# EAGLE design M-N-SRAM-V8 (EAGLE 9.6.2)
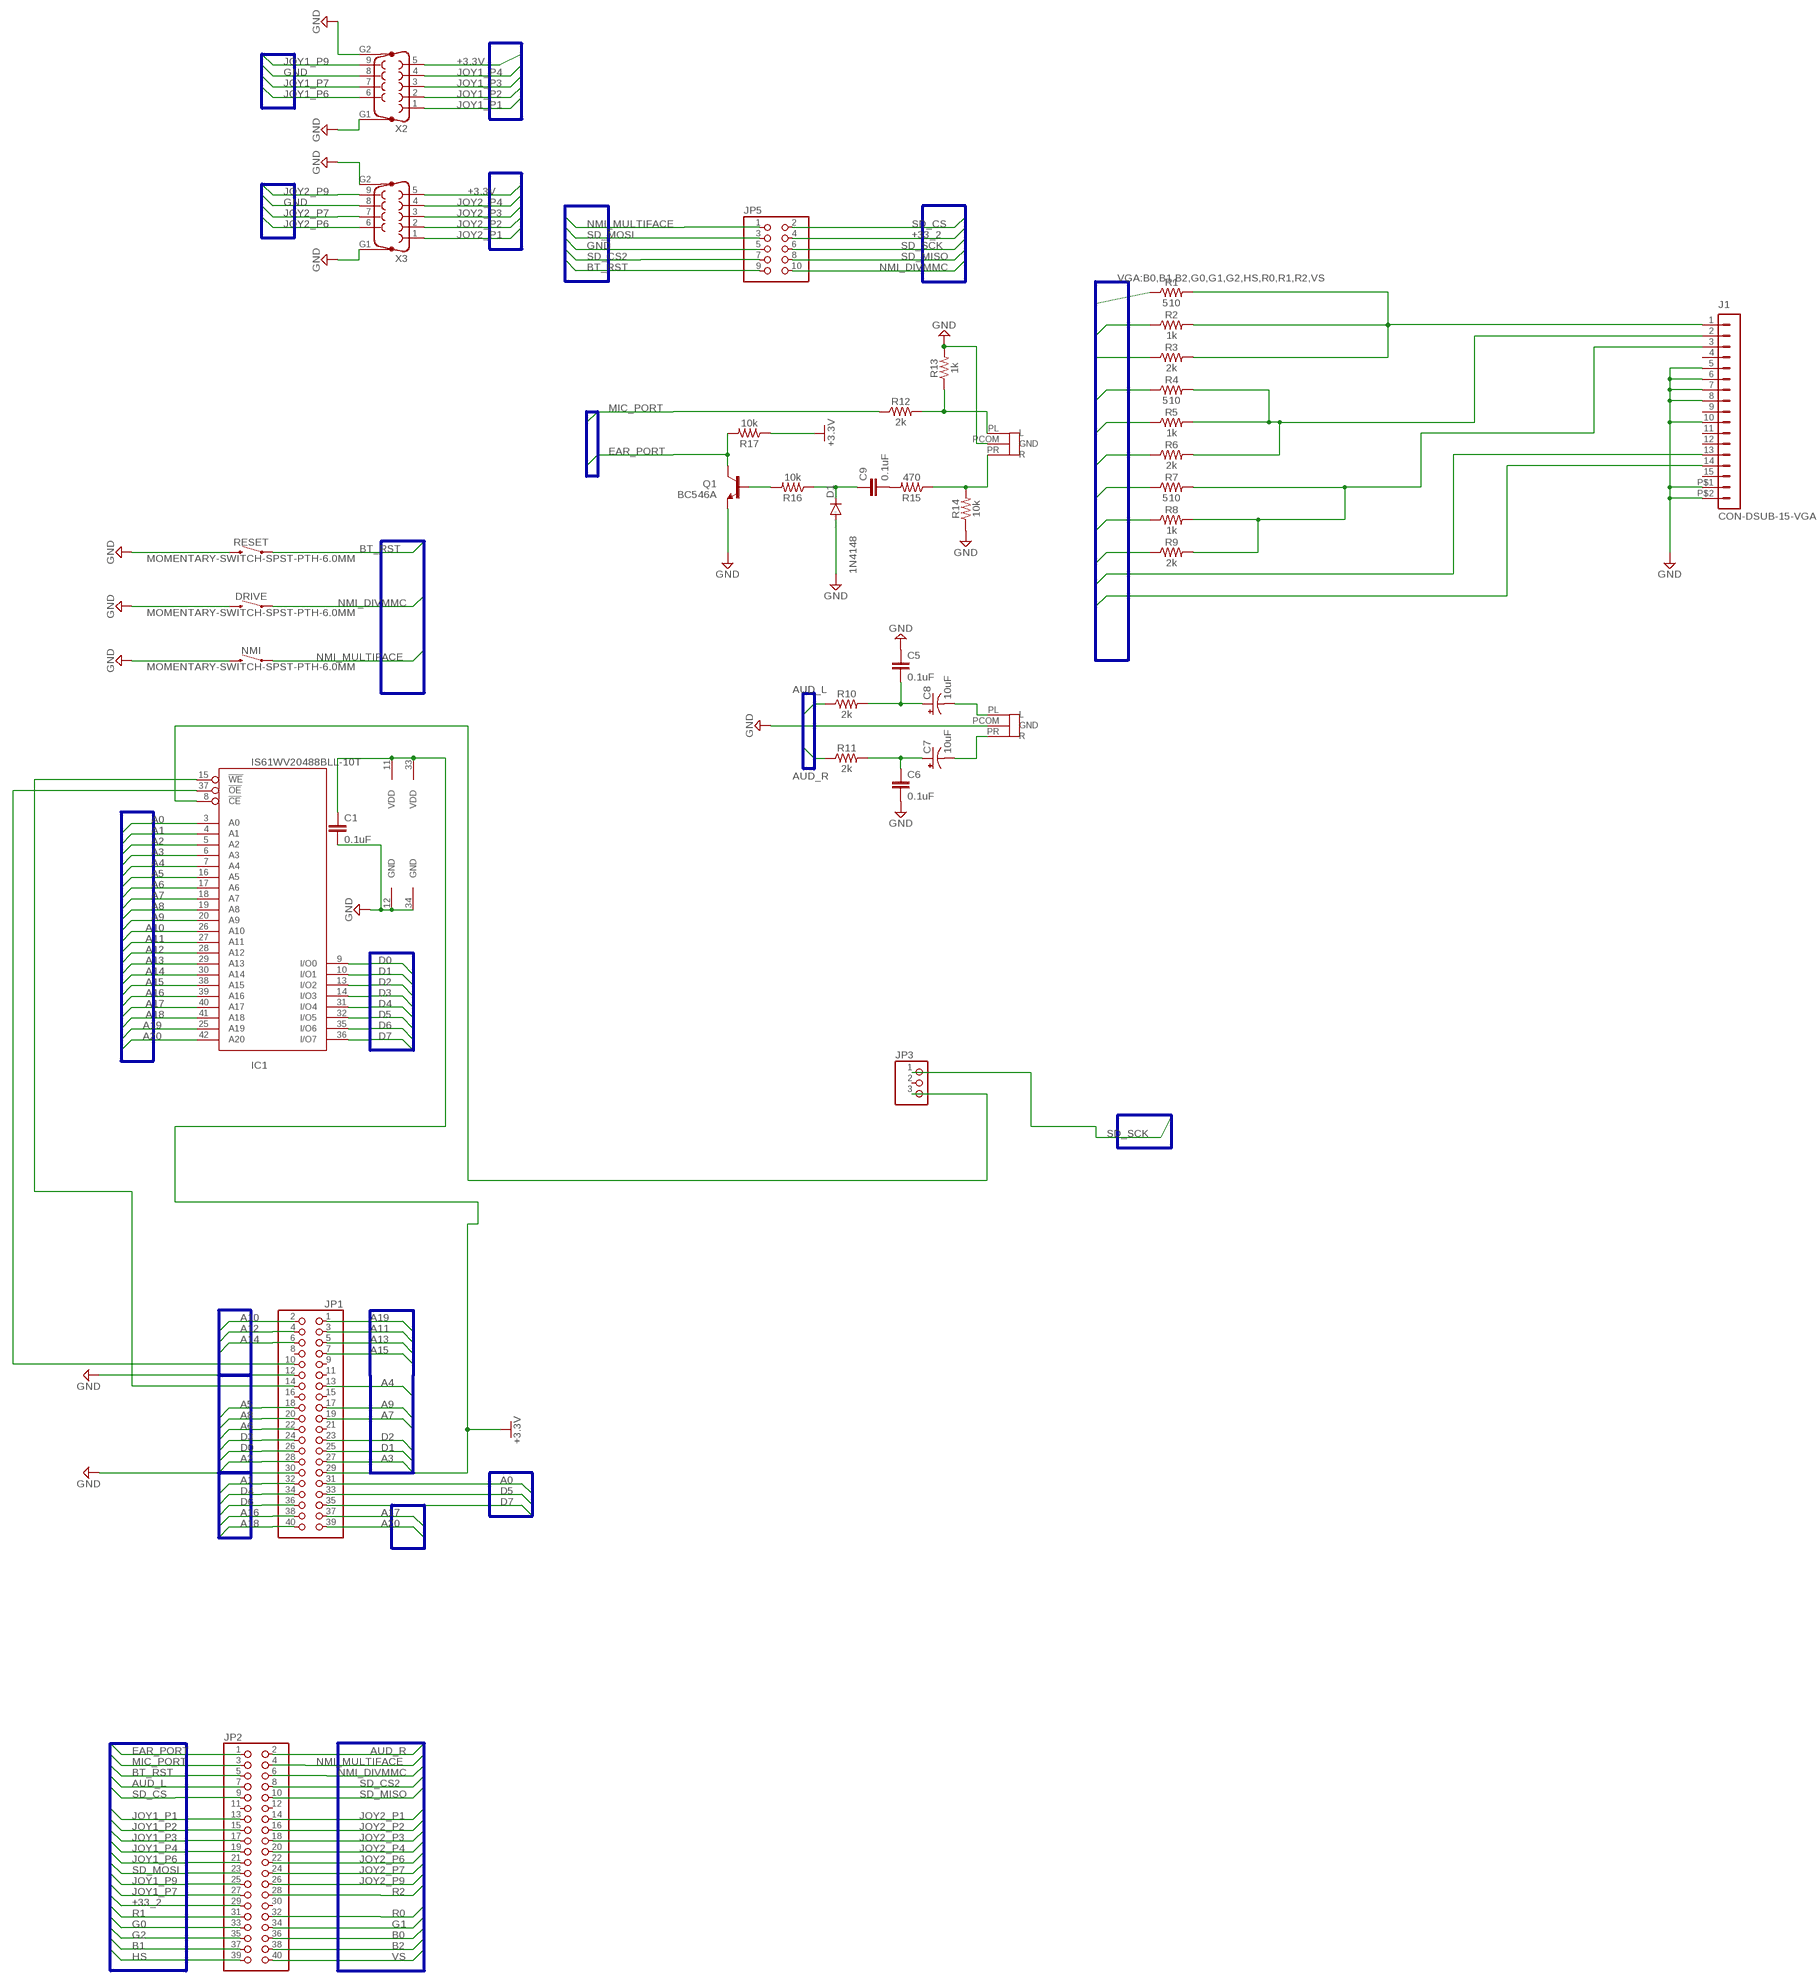
[diagram p0: schematic, sheet 1]

## Parts
AUDIOOUT  AUDIOJACK  [AUDIOJACK]
C1  0.1uF  0.1UF-KIT-EZ-50V-20%  [CAP-PTH-SMALL-KIT]
C5  0.1uF  0.1UF-KIT-EZ-50V-20%  [CAP-PTH-SMALL-KIT]
C6  0.1uF  0.1UF-KIT-EZ-50V-20%  [CAP-PTH-SMALL-KIT]
C7  10uF  10UF-POLAR-RADIAL-2.5MM-25V-20%  [CPOL-RADIAL-2.5MM-5MM]
C8  10uF  10UF-POLAR-RADIAL-2.5MM-25V-20%  [CPOL-RADIAL-2.5MM-5MM]
C9  0.1uF  0.1UF-KIT-EZ-50V-20%  [CAP-PTH-SMALL-KIT]
D1  1N4148  1N4148DO35-7  [DO35-7]
DRIVE  MOMENTARY-SWITCH-SPST-PTH-6.0MM  [TACTILE_SWITCH_PTH_6.0MM]
EAR/MIC  AUDIOJACK  [AUDIOJACK]
IC1  IS61WV20488BLL-10T  IS61WV20488ALL-20T  [TSOP-II-44]
J1  CON-DSUB-15-VGA  [181-015-212-171]
JP1  PINHD-2X20  [2X20]
JP2  PINHD-2X20  [2X20]
JP3  PINHD-1X3  [1X03]
JP5  PINHD-2X5  [2X05]
NMI  MOMENTARY-SWITCH-SPST-PTH-6.0MM  [TACTILE_SWITCH_PTH_6.0MM]
Q1  BC546A  [TO92-EBC]
R1  510  1KOHM-HORIZ-1/4W-1%  [AXIAL-0.3]
R2  1k  1KOHM-HORIZ-1/4W-1%  [AXIAL-0.3]
R3  2k  1KOHM-HORIZ-1/4W-1%  [AXIAL-0.3]
R4  510  1KOHM-HORIZ-1/4W-1%  [AXIAL-0.3]
R5  1k  1KOHM-HORIZ-1/4W-1%  [AXIAL-0.3]
R6  2k  1KOHM-HORIZ-1/4W-1%  [AXIAL-0.3]
R7  510  1KOHM-HORIZ-1/4W-1%  [AXIAL-0.3]
R8  1k  1KOHM-HORIZ-1/4W-1%  [AXIAL-0.3]
R9  2k  1KOHM-HORIZ-1/4W-1%  [AXIAL-0.3]
R10  2k  1KOHM-HORIZ-1/4W-1%  [AXIAL-0.3]
R11  2k  1KOHM-HORIZ-1/4W-1%  [AXIAL-0.3]
R12  2k  1KOHM-HORIZ-1/4W-1%  [AXIAL-0.3]
R13  1k  1KOHM-HORIZ-1/4W-1%  [AXIAL-0.3]
R14  10k  1KOHM-HORIZ-1/4W-1%  [AXIAL-0.3]
R15  470  1KOHM-HORIZ-1/4W-1%  [AXIAL-0.3]
R16  10k  1KOHM-HORIZ-1/4W-1%  [AXIAL-0.3]
R17  10k  1KOHM-HORIZ-1/4W-1%  [AXIAL-0.3]
RESET  MOMENTARY-SWITCH-SPST-PTH-6.0MM  [TACTILE_SWITCH_PTH_6.0MM]
X2  F09HP  [F09HP]
X3  F09HP  [F09HP]

## Nets
+3.3V: C1.1 IC1.11(VDD) IC1.33(VDD) JP1.29 R17.P$1 X2.5 X3.5
+33_2: JP2.29 JP5.4
A0: IC1.3(A0) JP1.31
A1: IC1.4(A1) JP1.32
A2: IC1.5(A2) JP1.28
A3: IC1.6(A3) JP1.27
A4: IC1.7(A4) JP1.13
A5: IC1.16(A5) JP1.18
A6: IC1.17(A6) JP1.22
A7: IC1.18(A7) JP1.19
A8: IC1.19(A8) JP1.20
A9: IC1.20(A9) JP1.17
A10: IC1.26(A10) JP1.2
A11: IC1.27(A11) JP1.3
A12: IC1.28(A12) JP1.4
A13: IC1.29(A13) JP1.5
A14: IC1.30(A14) JP1.6
A15: IC1.38(A15) JP1.7
A16: IC1.39(A16) JP1.38
A17: IC1.40(A17) JP1.37
A18: IC1.41(A18) JP1.40
A19: IC1.25(A19) JP1.1
A20: IC1.42(A20) JP1.39
AUD_L: JP2.7 R10.P$1
AUD_R: JP2.2 R11.P$1
AUDIO_OUT_L: AUDIOOUT.PL(L) C8.2(-)
AUDIO_OUT_L1: C5.2 C8.1(+) R10.P$2
AUDIO_OUT_R: AUDIOOUT.PR(R) C7.2(-)
AUDIO_OUT_R1: C6.1 C7.1(+) R11.P$2
B0: JP2.36 R7.P$1
B1: JP2.37 R8.P$1
B2: JP2.38 R9.P$1
BT_RST: JP2.5 JP5.9 RESET.1
D0: IC1.9(I/O0) JP1.26
D1: IC1.10(I/O1) JP1.25
D2: IC1.13(I/O2) JP1.23
D3: IC1.14(I/O3) JP1.24
D4: IC1.31(I/O4) JP1.34
D5: IC1.32(I/O5) JP1.33
D6: IC1.35(I/O6) JP1.36
D7: IC1.36(I/O7) JP1.35
EAR_PORT: JP2.1 Q1.C R17.P$2
G0: JP2.33 R4.P$1
G1: JP2.34 R5.P$1
G2: JP2.35 R6.P$1
GND: AUDIOOUT.PCOM(GND) C1.2 C5.1 C6.2 D1.A DRIVE.3 EAR/MIC.PCOM(GND) IC1.12(GND) IC1.34(GND) J1.5 J1.6 J1.7 J1.8 J1.10 J1.P$1 J1.P$2 JP1.12 JP1.30 JP5.5 NMI.3 Q1.E R13.P$2 R14.P$1 RESET.3 X2.8 X2.G1 X2.G2 X3.8 X3.G1 X3.G2
HS: J1.13 JP2.39
JOY1_P1: JP2.13 X2.1
JOY1_P2: JP2.15 X2.2
JOY1_P3: JP2.17 X2.3
JOY1_P4: JP2.19 X2.4
JOY1_P6: JP2.21 X2.6
JOY1_P7: JP2.27 X2.7
JOY1_P9: JP2.25 X2.9
JOY2_P1: JP2.14 X3.1
JOY2_P2: JP2.16 X3.2
JOY2_P3: JP2.18 X3.3
JOY2_P4: JP2.20 X3.4
JOY2_P6: JP2.22 X3.6
JOY2_P7: JP2.24 X3.7
JOY2_P9: JP2.26 X3.9
MIC_PORT: JP2.3 R12.P$1
N$5: EAR/MIC.PL(L) R12.P$2 R13.P$1
N$7: C9.2 R15.P$2
N$8: EAR/MIC.PR(R) R14.P$2 R15.P$1
N$9: C9.1 D1.C R16.P$1
N$10: Q1.B R16.P$2
NMI_DIVMMC: DRIVE.1 JP2.6 JP5.10
NMI_MULTIFACE: JP2.4 JP5.1 NMI.1
R0: JP2.32 R1.P$1
R1: JP2.31 R2.P$1
R2: JP2.28 R3.P$1
RAM_CE: IC1.8(!CE) JP3.3
RAM_OE: IC1.37(!OE) JP1.10
RAM_WE: IC1.15(!WE) JP1.14
SD_CS: JP2.9 JP5.2
SD_CS2: JP2.8 JP5.7
SD_MISO: JP2.10 JP5.8
SD_MOSI: JP2.23 JP5.3
SD_SCK: JP3.1 JP5.6
VGA_BLUE: J1.3 R7.P$2 R8.P$2 R9.P$2
VGA_GREEN: J1.2 R4.P$2 R5.P$2 R6.P$2
VGA_RED: J1.1 R1.P$2 R2.P$2 R3.P$2
VS: J1.14 JP2.40
Unconnected: J1.4 J1.9 J1.11 J1.12 J1.15 JP1.8 JP1.9 JP1.11 JP1.15 JP1.16 JP1.21 JP2.11 JP2.12 JP2.30 JP3.2

## Buses
ADDRESS:A0,A1,A2,A3,A4,A5,A6,A7,A8,A9,A10,A11,A12,A13,A14,A15,A16,A17,A18,A19,A20,D0,D3,D4,D6
DATA:A0,A1,A2,A3,A4,A5,A6,A7,A9,A11,A13,A15,A17,A19,A20,D0,D1,D2,D3,D4,D5,D6,D7,D8,D9,D10,D11,D12,D13,D14,D15
VGA:B0,B1,B2,G0,G1,G2,HS,R0,R1,R2,VS
AUDIO:AUD_L,AUD_R
EARMIC:EAR_PORT,MIC_PORT
JP2_ODD:+33_2,+33_3,AUD_L,B1,BT_RST,EAR_PORT,G0,G2,HS,JOY1_P1,JOY1_P2,JOY1_P3,JOY1_P4,JOY1_P6,JOY1_P7,JOY1_P9,MIC_PORT,R1,SD_CS,SD_MOSI
JP2_EVEN:+33_3,AUD_R,B0,B2,G1,GND,JOY2_P1,JOY2_P2,JOY2_P3,JOY2_P4,JOY2_P6,JOY2_P7,JOY2_P9,NMI_DIVMMC,NMI_MULTIFACE,R0,R2,SD_CS2,SD_MISO,VS
BUTTONS:BT_RST,NMI_DIVMMC,NMI_MULTIFACE
JOY1_2:+3.3V,JOY1_P1,JOY1_P2,JOY1_P3,JOY1_P4
JOY1_1:GND,JOY1_P6,JOY1_P7,JOY1_P9
JOY2_1:GND,JOY2_P6,JOY2_P7,JOY2_P9
JOY2_2:+3.3V,JOY2_P1,JOY2_P2,JOY2_P3,JOY2_P4
JP13_1:BT_RST,GND,NMI_MULTIFACE,SD_CS2,SD_MOSI
JP13_2:+33_2,NMI_DIVMMC,SD_CS,SD_MISO,SD_SCK
JP3:SD_SCK

## Library data of the parts
AUDIOOUT EAR/MIC = my-library:AUDIOJACK
C1 C5 C6 C9 = SparkFun-Capacitors:0.1UF: 0.1µF ceramic capacitors A capacitor is a passive two-terminal electrical component used to store electrical energy temporarily in an electric field.; PROD_ID: CAP-08370
C7 C8 = SparkFun-Capacitors:10UF-POLAR: 10.0µF polarized capacitors A capacitor is a passive two-terminal electrical component used to store electrical energy temporarily in an electric field.; PROD_ID: CAP-08440
D1 = diode:1N4148: DIODE high speed (Philips)
DRIVE NMI RESET = SparkFun-Switches:MOMENTARY-SWITCH-SPST: Momentary Switch (Pushbutton) - SPST Normally-open (NO) SPST momentary switches (buttons, pushbuttons). Variants PTH-12MM - 12mm square, through-hole Momentary Pushbutton Switch - 12mm Square <https://www.sparkfun.com/products/9190> (COM-09190) PTH-6.0MM, PTH-6.0MM-KIT - 6.0mm square, through-hole Mini Pushbutton Switch <https://www.sparkfun.com/products/97> (COM-00097) KIT package intended for soldering kit's - only one side of pads' copper is exposed. PTH-RIGHT-ANGLE-KIT - Right-angle, through-hole Right Angle Tactile Button <https://www.sparkfun.com/products/10791> - Used on SparkFun BigTime Watch Kit <https://www.sparkfun.com/products/11734> SMD-12MM - 12mm square, surface-mount Tactile Button - SMD (12mm) <https://www.sparkfun.com/products/12993> (COM-12993) Used on SparkFun PicoBoard <https://www.sparkfun.com/products/11888> SMD-4.5MM - 4.5mm Square Trackball Switch Used on SparkFun Blackberry Trackballer Breakout <https://www.sparkfun.com/products/13169> SMD-4.6MMX2.8MM - 4.60mm x 2.80mm, surface mount Used on SparkFun SAMD21 Mini Breakout <https://www.sparkfun.com/products/13664> SMD-5.2MM, SMD-5.2-REDUNDANT - 5.2mm square, surface-mount Mini Pushbutton Switch - SMD <https://www.sparkfun.com/products/8720> (COM-08720) Used on Arduino Pro Mini <https://www.sparkfun.com/products/11114> REDUNDANT package connects both switch circuits together SMD-6.0X3.5MM - 6.0 x 3.5mm, surface mount Momentary Reset Switch SMD <https://www.sparkfun.com/products/8229> (COM-08229) SMD-6.2MM-TALL - 6.2mm square, surface mount Tactile Button - SMD (6mm) <https://www.sparkfun.com/products/12992> Used on SparkFun Digital Sandbox <https://www.sparkfun.com/products/12651> SMD-RIGHT-ANGLE - Right-angle, surface mount Used on SparkFun Block for Intel® Edison - Arduino <https://www.sparkfun.com/products/13036>; PROD_ID: SWCH-08441; SF_SKU: COM-00097
IC1 = memory-issi-asynsram:IS61WV20488ALL-*: 2048k x 8 high- speed CMOS static RAM 20ns access time 2.2V power supply
J1 = m-pad-2.1:CON-DSUB-15-VGA: NORCOMP's High Density 90° PC Mount D-Sub Connector 181 Series: SPECIFICATIONS: Contact Rating: 5 Amps Dielectric Strength: 1000V AC RMS Insulation Resistance: 1000 meg ohms Contact Material: Phosphor Bronze Contact Finish: Gold flash over Nickel Operating Temperature: -55°C to 150°C Shell Material: Steel, Tin Plated Insulations Material: Glass-Filled Polyester (UL94V-0) Gender: Receptacle (female) Please send any comments to: messi@users.sourceforge.net
JP1 JP2 = pinhead:PINHD-2X20: PIN HEADER
JP3 = pinhead:PINHD-1X3: PIN HEADER
JP5 = pinhead:PINHD-2X5: PIN HEADER
Q1 = transistor-npn:BC546*: NPN Transistor
R1 R3 R4 R6 R7 R9-R12 R14-R17 = SparkFun-Resistors:1KOHM: 1kΩ resistor A resistor is a passive two-terminal electrical component that implements electrical resistance as a circuit element. Resistors act to reduce current flow, and, at the same time, act to lower voltage levels within circuits. - Wikipedia; PROD_ID: RES-12182; VALUE: 1k
R2 R5 R8 R13 = SparkFun-Resistors:1KOHM: 1kΩ resistor A resistor is a passive two-terminal electrical component that implements electrical resistance as a circuit element. Resistors act to reduce current flow, and, at the same time, act to lower voltage levels within circuits. - Wikipedia; PROD_ID: RES-12182
X2 X3 = con-subd:F09HP: SUB-D; OC_FARNELL: unknown; OC_NEWARK: unknown

## Board
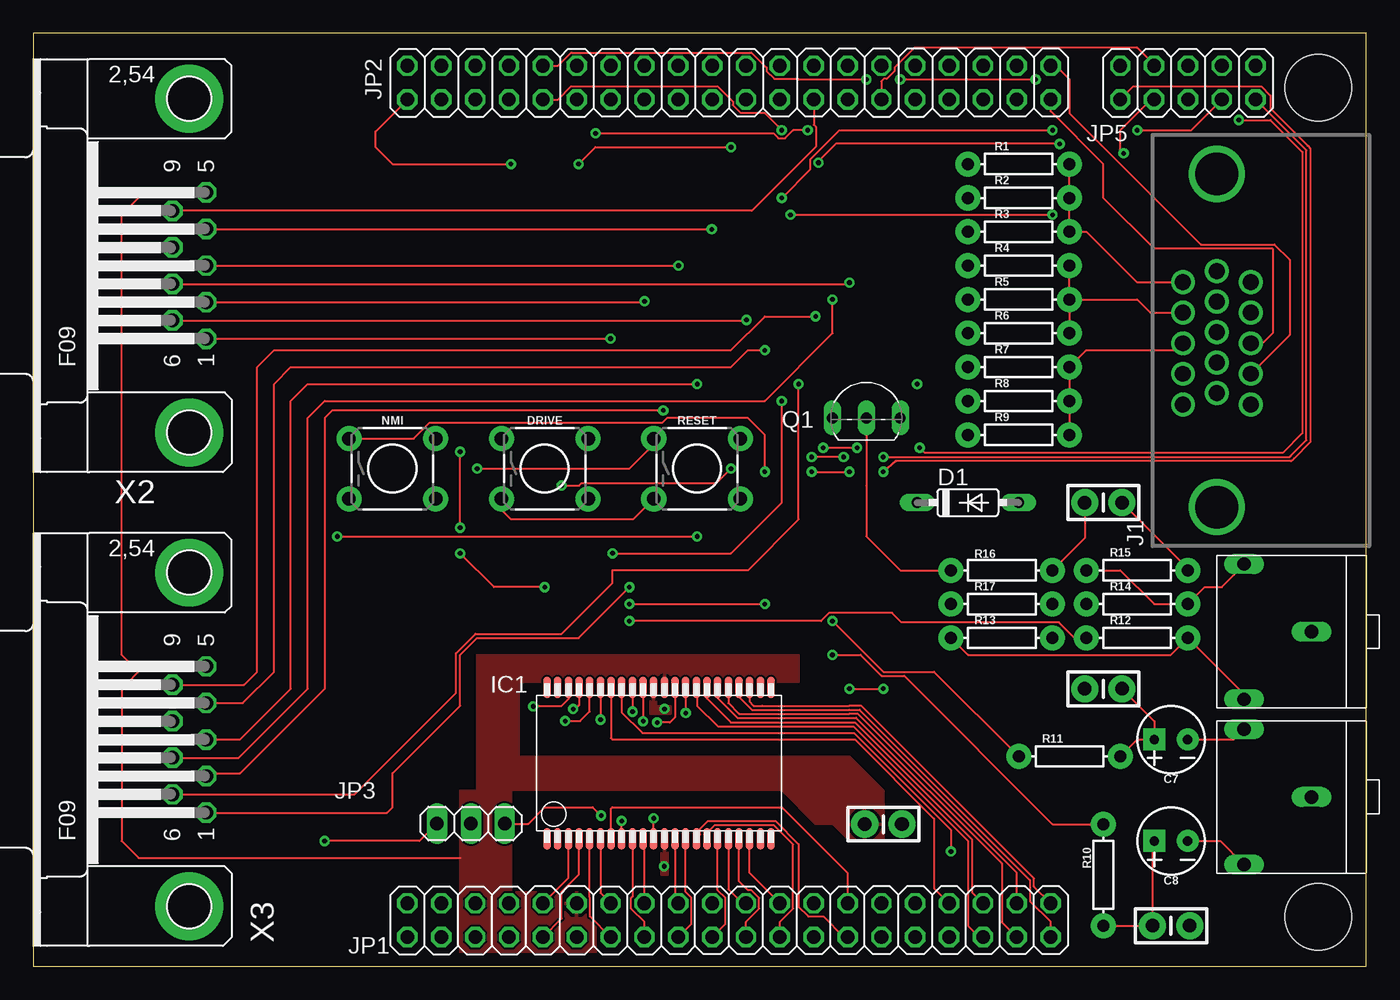
[diagram p1: board, top side]
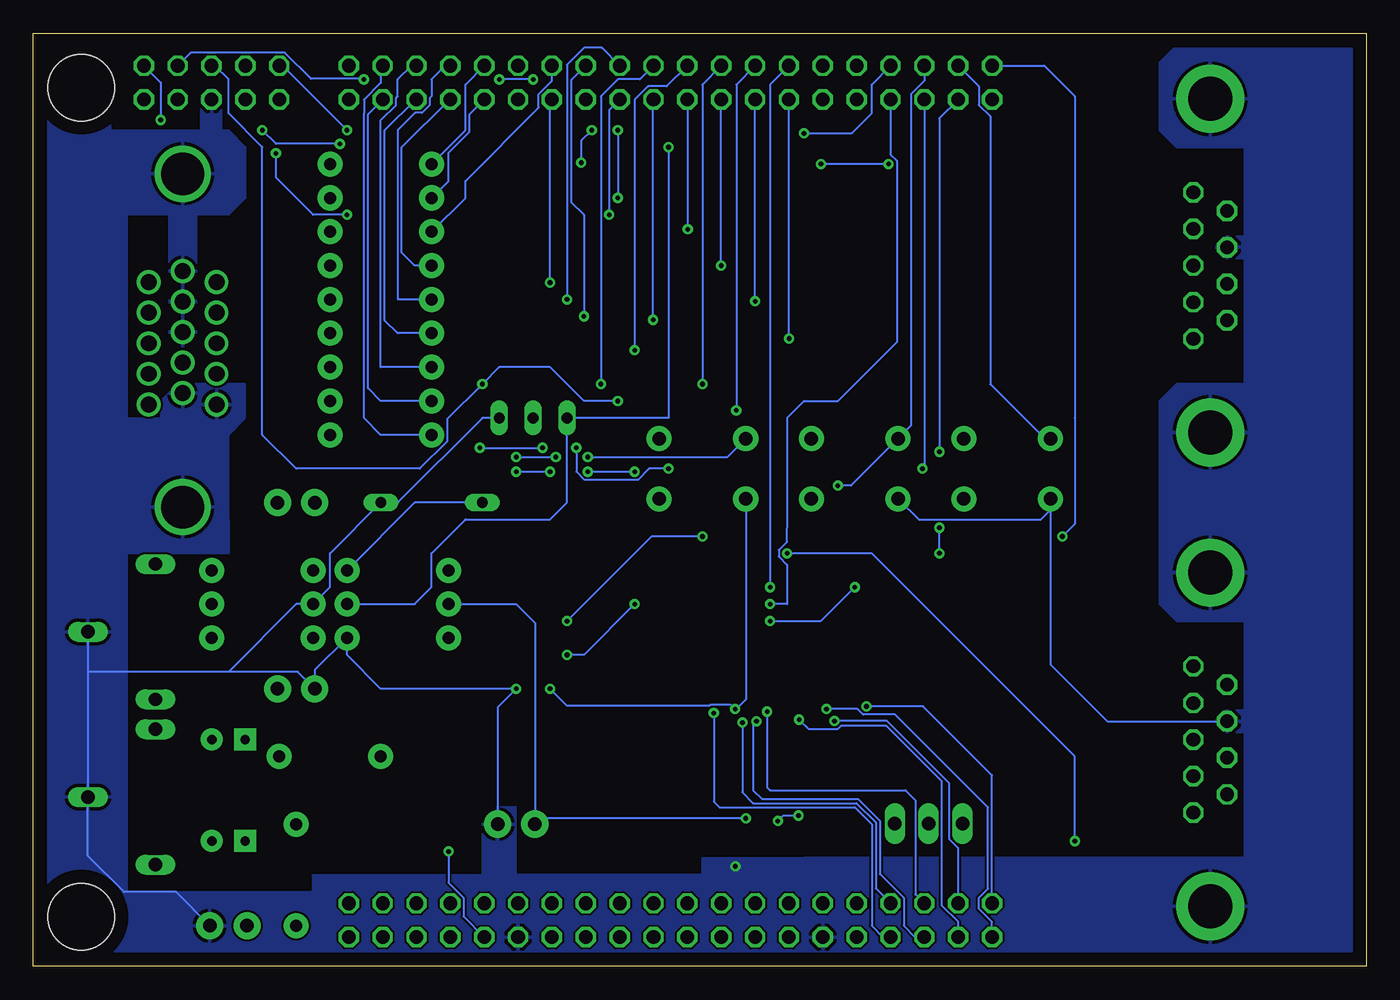
[diagram p2: board, bottom side, seen from below]

Size 100 x 70 mm. Coordinates in mm from the lower left corner, seen from the top.
Outline: 0,0 100,0 100,70 0,70 0,0
Copper layers (1*16): Top 0.035mm / dielectric 1.5mm / Bottom 0.035mm
Design rules "default": minimum track width 6mil, minimum drill 0.35mm, track to track 6mil, track to pad 6mil, pad to pad 6mil, via to via 6mil, smd to smd 6mil, copper to edge 40mil, drill to drill 6mil, minimum pad ring 10mil, minimum via ring 8mil, stop-mask expansion 4mil, vias tented up to drill 0mil, thermal gap 10mil
Holes 5 mm at 96.4,3.7 96.4,65.93

### Footprints (pad centres in the part's own frame; a part is rotated, then mirrored left to right if it is on the bottom)
AUDIOJACK = drill 1 long: PCOM 0,-3.81; PL -5.08,1.27; PR 5.08,1.27
CAP-PTH-SMALL-KIT = drill 1.016 pad 2.032: 1 -1.397,0; 2 1.397,0
CPOL-RADIAL-2.5MM-5MM = drill 0.7 pad 1.651 square: 1 1.25,0 | drill 0.7 pad 1.651: 2 -1.25,0
DO35-7 = drill 0.813 long: A 3.81,0; C -3.81,0
TACTILE_SWITCH_PTH_6.0MM = drill 1.016 pad 1.88: 1 -3.251,2.261; 2 3.251,2.261; 3 -3.251,-2.261; 4 3.251,-2.261
TSOP-II-44 = smd 0.55 x 1.6: 1 -8.4,-5.68; 2 -7.6,-5.68; 3 -6.8,-5.68; 4 -6,-5.68; 5 -5.2,-5.68; 6 -4.4,-5.68; 7 -3.6,-5.68; 8 -2.8,-5.68; 9 -2,-5.68; 10 -1.2,-5.68; 11 -0.4,-5.68; 12 0.4,-5.68; 13 1.2,-5.68; 14 2,-5.68; 15 2.8,-5.68; 16 3.6,-5.68; 17 4.4,-5.68; 18 5.2,-5.68; 19 6,-5.68; 20 6.8,-5.68; 21 7.6,-5.68; 22 8.4,-5.68; 23 8.4,5.68; 24 7.6,5.68; 25 6.8,5.68; 26 6,5.68; 27 5.2,5.68; 28 4.4,5.68; 29 3.6,5.68; 30 2.8,5.68; 31 2,5.68; 32 1.2,5.68; 33 0.4,5.68; 34 -0.4,5.68; 35 -1.2,5.68; 36 -2,5.68; 37 -2.8,5.68; 38 -3.6,5.68; 39 -4.4,5.68; 40 -5.2,5.68; 41 -6,5.68; 42 -6.8,5.68; 43 -7.6,5.68; 44 -8.4,5.68
181-015-212-171 = drill 1.194: 1 4.371,2.541; 2 2.08,2.541; 3 -0.211,2.541; 4 -2.502,2.541; 5 -4.793,2.541; 6 5.217,0; 7 2.926,0; 8 0.635,0; 9 -1.656,0; 10 -3.947,0; 11 4.371,-2.541; 12 2.08,-2.541; 13 -0.211,-2.541; 14 -2.502,-2.541; 15 -4.793,-2.541 | drill 3.2: P$1 -12.502,0; P$2 12.502,0
2X20 = drill 1.016 octagon: 1 -24.13,-1.27; 2 -24.13,1.27; 3 -21.59,-1.27; 4 -21.59,1.27; 5 -19.05,-1.27; 6 -19.05,1.27; 7 -16.51,-1.27; 8 -16.51,1.27; 9 -13.97,-1.27; 10 -13.97,1.27; 11 -11.43,-1.27; 12 -11.43,1.27; 13 -8.89,-1.27; 14 -8.89,1.27; 15 -6.35,-1.27; 16 -6.35,1.27; 17 -3.81,-1.27; 18 -3.81,1.27; 19 -1.27,-1.27; 20 -1.27,1.27; 21 1.27,-1.27; 22 1.27,1.27; 23 3.81,-1.27; 24 3.81,1.27; 25 6.35,-1.27; 26 6.35,1.27; 27 8.89,-1.27; 28 8.89,1.27; 29 11.43,-1.27; 30 11.43,1.27; 31 13.97,-1.27; 32 13.97,1.27; 33 16.51,-1.27; 34 16.51,1.27; 35 19.05,-1.27; 36 19.05,1.27; 37 21.59,-1.27; 38 21.59,1.27; 39 24.13,-1.27; 40 24.13,1.27
1X03 = drill 1.016 long: 1 -2.54,0; 2 0,0; 3 2.54,0
2X05 = drill 1.016 octagon: 1 -5.08,-1.27; 2 -5.08,1.27; 3 -2.54,-1.27; 4 -2.54,1.27; 5 0,-1.27; 6 0,1.27; 7 2.54,-1.27; 8 2.54,1.27; 9 5.08,-1.27; 10 5.08,1.27
TO92-EBC = drill 0.813 long: B 0,-1.27; C -2.54,-1.27; E 2.54,-1.27
AXIAL-0.3 = drill 0.9 pad 1.88: P$1 -3.81,0; P$2 3.81,0
F09HP = drill 1.016 octagon: 1 -5.486,-1.27; 2 -2.743,-1.27; 3 0,-1.27; 4 2.743,-1.27; 5 5.486,-1.27; 6 -4.115,1.27; 7 -1.372,1.27; 8 1.372,1.27; 9 4.115,1.27 | drill 3.302 pad 5.08: G1 -12.522,0; G2 12.522,0

### Placement (x,y rotation side)
AUDIOOUT  92.1,12.7 90 top
C1  63.77,10.66 0 top
C5  85.36,3.04 180 top
C6  80.28,20.82 180 top
C7  85.36,17.01 180 top
C8  85.36,9.39 180 top
C9  80.28,34.79 0 top
D1  70.12,34.79 0 top
DRIVE  38.37,37.33 0 top
EAR/MIC  92.1,25.1 90 top
IC1  46.94,15.24 0 top
J1  88.8,46.95 90 top
JP1  52.2,3.45 180 top
JP2  52.2,66.3 0 top
JP3  32.83,10.7 0 top
JP5  86.63,66.3 0 top
NMI  26.94,37.33 0 top
Q1  62.5,42.41 0 top
R1  73.93,60.19 0 top
R2  73.93,57.65 0 top
R3  73.93,55.11 0 top
R4  73.93,52.57 0 top
R5  73.93,50.03 0 top
R6  73.93,47.49 0 top
R7  73.93,44.95 0 top
R8  73.93,42.41 0 top
R9  73.93,39.87 0 top
R10  80.28,6.85 270 top
R11  77.74,15.74 0 top
R12  82.82,24.63 0 top
R13  72.66,24.63 0 top
R14  82.82,27.17 0 top
R15  82.82,29.71 0 top
R16  72.66,29.71 180 top
R17  72.66,27.17 0 top
RESET  49.8,37.33 0 top
X2  11.7,52.57 90 top
X3  11.7,17.01 90 top

### Tracks (layer width: path | path; a pad name or v marks a point on that pad's centre or on a via)
+3.3V  (via drill 0.35)
  Top 0.152: IC1.11 v46.54,11.1 | X3.5 8.3,22.5 | 32.02,8.12 7.89,8.12 6.62,9.39 6.62,20.82 8.3,22.5 | X2.5 8.3,58.06 6.62,56.38 6.62,23.36 7.48,22.5 8.3,22.5
  Bottom 0.152: v46.54,11.1 61.93,11.1 C1.1 62.37,25.77 63.77,27.17 R17.P$1
  pour Top: 63.77,11.93 63.77,9.39 61.23,9.39 58.69,11.93
  pour Top: 36.4,15.74 61.23,15.74 62.5,14.47 63.77,13.2 63.77,10.66 58.69,10.66 56.15,13.2 33.29,13.2 33.29,23.36 36.4,23.36
  pour Top: 35.83,23.36 57.42,23.36 57.42,21.3 35.83,21.3
  pour Top: 34.56,13.2 33.29,13.2 33.29,12.5 35.83,12.5 35.83,13.2
  pour Top: 42.18,5.58 42.18,0.5 32.02,0.5 32.02,13.2 35.83,13.2 35.83,5.58
+33_2
  Top 0.152: JP5.4 84.09,67.64 82.82,68.91 66.11,68.91 64.62,67.42 64.62,67.16 64.04,66.58 63.81,66.58 63.63,66.4 JP2.29
A0
  Top 0.152: JP1.31 40.14,6.63 IC1.3
A1
  Top 0.152: JP1.32 39.64,3.59 39.64,5.58 40.94,6.88 IC1.4
A2
  Top 0.152: IC1.5 41.74,5.15 41.76,5.13 41.76,3.73 JP1.28
A3
  Top 0.152: IC1.6 42.54,5.49 JP1.27
A4
  Top 0.152: IC1.7 43.34,11.82 43.45,11.93 56.15,11.93 61.09,6.99 JP1.13
A5
  Top 0.152: JP1.18 56.01,3.32 57,4.31 57,9.14 55.55,10.59 51.13,10.59 50.54,10 IC1.16
A6
  Top 0.152: IC1.17 51.34,5.71 51.92,5.13 51.92,3.17 JP1.22
A7
  Top 0.152: IC1.18 52.14,5.78 53.2,4.72 JP1.19
A8
  Top 0.152: JP1.20 53.47,3.32 54.46,4.31 54.46,5.13 53.88,5.71 53.61,5.71 52.94,6.38 IC1.19
A9
  Top 0.152: JP1.17 53.74,6.99 IC1.20
A10
  Top 0.152: JP1.2 76.33,3.32 74.78,4.87 74.78,6.45 61.99,19.25 61.23,19.25 53.91,19.25 52.94,20.22 IC1.26
A11
  Top 0.152: IC1.27 52.14,19.75 52.95,18.94 61.23,18.94 61.86,18.94 73.79,7.01 JP1.3
A12
  Top 0.152: JP1.4 72.66,3.31 72.66,7.71 61.74,18.64 52.82,18.64 51.34,20.12 IC1.28
A13
  Top 0.152: JP1.5 70.42,5.54 70.42,9.52 61.66,18.28 52.34,18.28 50.54,20.08 IC1.29
A14
  Top 0.152: JP1.6 70.98,2.18 70.12,3.04 70.12,9.39 61.53,17.98 51.38,17.98 49.8,19.55 49.8,20.86 IC1.30
A15
  Top 0.152: IC1.38 43.34,17.12 43.45,17.01 61.64,17.01 67.58,11.07 67.58,5.85 JP1.7
A16  (via drill 0.35)
  Top 0.152: IC1.39 v42.54,18.51 v42.55,18.5
  Bottom 0.152: JP1.38 30.61,3.32 31.84,4.55 31.84,13.86 36.05,18.06 39.38,18.06 39.4,18.04 39.65,17.79 41.84,17.79 v42.55,18.5
A17  (via drill 0.35)
  Top 0.152: IC1.40 41.74,19.11 41.03,18.4 v39.9,18.4
  Bottom 0.152: JP1.37 30.61,8.86 31.28,9.53 31.28,13.73 35.95,18.4 v39.9,18.4
A18  (via drill 0.35)
  Top 0.152: IC1.41 40.94,19.58 40.66,19.3 v40.5,19.3
  Bottom 0.152: JP1.40 28.07,3.32 29.06,4.31 29.06,5.13 28.38,5.82 28.38,11.93 35.34,18.89 37.75,18.89 38.16,19.3 v40.5,19.3
A19
  Top 0.152: IC1.25 53.74,19.85 54.04,19.55 54.67,19.55 61.23,19.55 62.12,19.55 75.08,6.58 75.08,5.96 JP1.1
A20  (via drill 0.35)
  Top 0.152: IC1.42 40.14,20.05 39.59,19.5 v37.5,19.5
  Bottom 0.152: JP1.39 28.07,14.33 33.24,19.5 v37.5,19.5
AUD_L  (via drill 0.35)
  Top 0.152: v44.72,27.17 v54.88,27.17 | v59.96,23.36 62.07,23.36 63.64,21.79 65.34,21.79 76.47,10.66 R10.P$1
  Bottom 0.152: JP2.7 35.69,60.91 35.22,60.44 35.22,46.83 39.64,42.41 42.18,42.41 43.45,41.14 43.45,32.9 43.45,31.84 44.06,31.23 44.06,30.73 43.45,30.12 43.45,27.17 v44.72,27.17 | v54.88,27.17 58.69,23.36 v59.96,23.36
AUD_R  (via drill 0.35)
  Top 0.152: v22.8,32.25 v49.8,32.25 | R11.P$1 67.58,22.09 63.77,22.09 v59.96,25.9
  Bottom 0.152: JP2.2 24.16,67.57 21.86,65.27 21.86,41.14 21.86,33.19 v22.8,32.25 | v49.8,32.25 53.61,32.25 v59.96,25.9
AUDIO_OUT_L
  Top 0.152: C8.2 89.06,9.39 AUDIOOUT.PL
AUDIO_OUT_L1
  Top 0.152: R10.P$2 C5.2 83.96,9.24 C8.1
AUDIO_OUT_R
  Top 0.152: C7.2 90.06,17.01 AUDIOOUT.PR
AUDIO_OUT_R1
  Top 0.152: C6.1 84.11,18.39 C7.1 82.82,17.01 R11.P$2
B0
  Bottom 0.152: R7.P$1 73.93,44.95 73.93,63.49 72.8,64.62 72.8,65.13 72.66,65.27 72.66,66.54 71.63,67.57 JP2.36
B1
  Bottom 0.152: R8.P$1 73.93,42.41 74.89,43.38 74.89,63.92 JP2.37
B2
  Bottom 0.152: R9.P$1 73.93,39.87 75.2,41.14 75.2,64 75.2,65.02 73.93,66.29 73.93,67.43 JP2.38
BT_RST  (via drill 0.35)
  Top 0.152: v33.29,37.33 44.72,37.33 46.55,39.16 RESET.1 | JP5.9 95.52,61.22 95.52,39.48 94.36,38.31 94.3,38.23 94.27,38.22 94.25,38.2 v63.77,38.2 | v60.8,38.2 v58.4,38.2
  Bottom 0.152: JP2.5 33.15,37.47 v33.29,37.33 | v63.77,38.2 v60.8,38.2 | v58.4,38.2 47.94,38.2 RESET.1
D0
  Top 0.152: JP1.26 45.85,3.32 44.86,4.31 44.86,5.13 44.94,5.21 IC1.9
D1
  Top 0.152: JP1.25 45.85,9.45 IC1.10
D2
  Top 0.152: IC1.13 48.14,4.97 JP1.23
D3
  Top 0.152: IC1.14 48.94,5.57 49.38,5.13 49.38,3.17 JP1.24
D4  (via drill 0.35)
  Top 0.152: IC1.31 v48.94,19.01 v48.95,19
  Bottom 0.152: v48.95,19 48.95,12.35 48.53,11.93 38.37,11.93 37.1,10.66 37.1,3.04 36.24,2.18 JP1.34
D5  (via drill 0.35)
  Top 0.152: IC1.32 48.14,18.67 47.75,18.28 v46.8,18.28
  Bottom 0.152: v46.8,18.28 46.8,13.04 45.99,12.23 38.24,12.23 36.8,10.79 36.8,5.83 JP1.33
D6  (via drill 0.35)
  Top 0.152: IC1.35 v45.75,18.38
  Bottom 0.152: v45.75,18.38 45.99,18.14 45.99,13.2 45.33,12.54 38.12,12.54 36.49,10.91 36.49,6.92 34.7,5.13 34.7,3.04 33.84,2.18 JP1.36
D7  (via drill 0.35)
  Top 0.152: IC1.36 v44.94,19.11 v44.95,19.1
  Bottom 0.152: v44.95,19.1 44.95,13.43 44.72,13.2 34.56,13.2 33.82,12.46 33.82,5.39 JP1.35
EAR_PORT  (via drill 0.35)
  Top 0.152: JP2.1 25.67,62.63 25.67,61.46 26.94,60.19 v35.83,60.19 | v40.91,60.19 42.18,61.46 v52.34,61.46
  Bottom 0.152: R17.P$2 71.39,27.17 70.12,28.44 70.12,30.98 67.58,33.52 61.23,33.52 59.96,34.79 Q1.C 52.34,41.14 v52.34,61.46 | v35.83,60.19 v40.91,60.19
G0
  Bottom 0.152: R4.P$1 71.39,52.57 72.36,53.53 72.36,61.46 68.78,65.03 JP2.33
G1
  Bottom 0.152: R5.P$1 72.66,50.03 72.66,62.73 71.35,64.04 70.84,64.04 70.26,64.62 70.26,65.13 70.12,65.27 70.12,66.54 69.09,67.57 JP2.34
G2
  Bottom 0.152: R6.P$1 72.66,47.49 73.62,48.45 73.62,62.73 71.33,65.03 JP2.35
GND  (via drill 0.35)
  Top 0.152: RESET.3 45,33.52 35.83,33.52 35.12,34.23 DRIVE.3 | v61.23,20.82 v63.77,20.82
  Bottom 0.152: C5.1 89.3,5.58 93.2,5.58 95.91,8.29 AUDIOOUT.PCOM 95.91,22.09 | EAR/MIC.PCOM 95.91,22.09 | 85.36,22.09 80.15,22.09 C6.2 78.88,22.22 R13.P$2 76.47,23.36 73.93,20.82 v63.77,20.82 65.17,19.42 C1.2 | 85.36,22.09 95.91,22.09 | 85.36,22.09 80.28,27.17 R14.P$1 77.74,28.44 77.74,30.98 D1.A 72.66,34.79 66.31,41.14 Q1.E | DRIVE.3 33.57,33.52 24.4,33.52 23.69,34.23 NMI.3 23.69,22.65 19.42,18.38 X3.8 | v61.23,20.82 59.96,19.55 49.26,19.55 49.2,19.61 47.66,19.61 v47.35,19.3 47.26,19.3 46.55,20.01 RESET.3
  other vias: 47.33,7.5
  pour Top: 46.7,20.82 46.7,19.55 47.8,18.9 46.3,18.9 46.3,19.55 46.3,20.82
  pour Top: 46.7,19.55 47.8,19.55 47.8,18.9 46.7,18.9
  pour Bottom: 39.64,0.5 49.8,0.5 49.8,8.12 39.64,8.12
  pour Top: 47.1,9.39 47.1,6.85 47.6,6.85 47.6,9.39
  pour Bottom: 92.98,30.98 92.98,5.58 86.63,5.58 86.63,1.77 87.9,0.5 99.33,0.5 99.33,30.98
  pour Bottom: 84.09,43.68 89.17,43.68 90.44,42.41 90.44,38.6 96.79,38.6 98.06,37.33 99.33,36.06 99.33,30.98 92.98,30.98 92.98,32.25 85.36,32.25 85.36,39.87 84.09,41.14
  pour Bottom: 49.8,6.85 65.04,6.85 65.04,0.5 49.8,0.5
  pour Bottom: 63.77,6.85 63.77,11.93 66.31,11.93 66.31,6.85
  pour Bottom: 85.36,33.52 85.36,30.98 98.06,30.98 98.06,33.52
  pour Bottom: 95.52,30.98 99.33,30.98 99.33,69.08 94.25,69.08 94.25,62.73 86.63,62.73 85.36,62.73 84.09,61.46 84.09,57.65 85.36,56.38 92.98,56.38 92.98,41.14 89.17,41.14 89.17,30.98
  pour Bottom: 85.9,65.8 85.9,62.73 87.4,62.73 87.4,65.8
  pour Bottom: 86.63,5.58 79.01,5.58 79.01,6.85 65.04,6.85 65.04,0.5 89.17,0.5 89.17,5.58
  pour Bottom: 42.18,0.5 14.24,0.5 14.24,8.12 42.18,8.12
  pour Bottom: 19.32,0.5 0.27,0.5 0.27,69.08 14.24,69.08 15.51,67.81 15.51,62.73 14.24,61.46 9.16,61.46 9.16,54.75 11.3,54.75 11.3,53.15 9.16,53.15 9.16,43.68 14.24,43.68 15.51,42.41 15.51,27.17 14.24,25.9 9.16,25.9 9.16,19.2 11.3,19.2 11.3,17.6 9.16,17.6 9.16,8.12 19.32,8.12
  pour Bottom: 87.8,56.38 87.8,46.5 89.8,46.5 89.8,56.38
HS
  Top 0.152: JP2.39 76.33,64.14 80.28,60.19 80.28,57.65 84.09,53.84 92.98,53.84 92.98,47.49 92.25,46.76 91.36,46.76 J1.13
JOY1_P1  (via drill 0.35)
  Top 0.152: X2.1 43.28,47.08 v43.3,47.1
  Bottom 0.152: v43.3,47.1 v43.31,47.11 JP2.13
JOY1_P2  (via drill 0.35)
  Top 0.152: X2.2 45.78,49.83 v45.85,49.9
  Bottom 0.152: v45.85,49.9 JP2.15
JOY1_P3  (via drill 0.35)
  Top 0.152: X2.3 v48.4,52.57
  Bottom 0.152: v48.4,52.57 JP2.17
JOY1_P4  (via drill 0.35)
  Top 0.152: v50.9,55.3 50.89,55.31 X2.4
  Bottom 0.152: v50.9,55.3 50.9,65 JP2.19
JOY1_P6  (via drill 0.35)
  Top 0.152: v53.5,48.5 53.45,48.45 X2.6
  Bottom 0.152: v53.5,48.5 53.5,65 JP2.21
JOY1_P7  (via drill 0.35)
  Top 0.152: v61.23,51.3 61.13,51.2 X2.7
  Bottom 0.152: v61.23,51.3 61.23,64.89 JP2.27
JOY1_P9
  Top 0.152: X2.9 53.91,56.69 58.71,61.48 58.71,62.98 58.55,63.14 JP2.25
JOY2_P1  (via drill 0.35)
  Top 0.152: X3.1 26.53,11.52 26.94,11.93 26.94,14.47 32.02,19.55 32.02,23.36 33.29,24.63 40.91,24.63 v44.72,28.44
  Bottom 0.152: JP2.14 44.72,66.16 v44.72,28.44
JOY2_P2  (via drill 0.35)
  Top 0.152: X3.2 13.17,14.47 15.51,14.47 21.86,20.82 21.86,41.14 22.42,41.7 v47.26,41.7
  Bottom 0.152: JP2.16 47.26,66.16 v47.26,41.7
JOY2_P3  (via drill 0.35)
  Top 0.152: X3.3 15.51,17.01 19.32,20.82 19.32,42.41 20.59,43.68 v49.8,43.68
  Bottom 0.152: JP2.18 49.8,66.16 v49.8,43.68
JOY2_P4  (via drill 0.35)
  Top 0.152: X3.4 15.71,19.75 18.05,22.09 18.05,43.68 19.32,44.95 52.34,44.95 53.61,46.22 v54.88,46.22
  Bottom 0.152: JP2.20 52.48,66.02 53.88,66.02 54.88,65.02 v54.88,46.22
JOY2_P6  (via drill 0.35)
  Top 0.152: X3.6 24.09,12.89 31.72,20.52 31.72,23.49 33.16,24.93 39.64,24.93 43.45,28.75 43.45,29.71 53.61,29.71 57.42,33.52 v57.42,43.68
  Bottom 0.152: JP2.22 54.5,66.54 56.15,66.54 57.42,65.27 v57.42,43.68
JOY2_P7  (via drill 0.35)
  Top 0.152: X3.7 15.41,15.64 20.59,20.82 20.59,41.14 21.86,42.41 54.88,42.41 59.96,47.49 v59.96,50.03
  Bottom 0.152: JP2.24 57.35,68.91 58.69,68.91 59.96,67.64 v59.96,50.03
JOY2_P9  (via drill 0.35)
  Top 0.152: X3.9 15.82,21.12 16.78,22.09 16.78,44.95 18.05,46.22 52.34,46.22 54.88,48.76 v58.69,48.76
  Bottom 0.152: JP2.26 59.66,66.47 59.66,57.34 58.69,56.38 v58.69,48.76
MIC_PORT  (via drill 0.35)
  Top 0.152: R12.P$1 78.12,24.63 76.95,25.8 65.14,25.8 64.43,26.51 59.71,26.51 59.1,25.9 v44.72,25.9 | v38.37,28.44 34.56,28.44 v32.02,30.98 | v32.02,32.9 v32.02,38.6
  Bottom 0.152: v44.72,25.9 40.91,25.9 v38.37,28.44 | v32.02,30.98 v32.02,32.9 | JP2.3 32.02,63.62 v32.02,38.6
N$5
  Top 0.152: EAR/MIC.PL 90.83,20.43 R12.P$2 85.36,23.36 70.12,23.36 R13.P$1
N$7
  Top 0.152: C9.2 86.63,29.84 R15.P$2
N$8
  Top 0.152: EAR/MIC.PR 90.83,30.1 89.17,28.44 87.9,28.44 R14.P$2 84.09,27.17 81.55,29.71 R15.P$1
N$9
  Top 0.152: C9.1 78.88,32.12 R16.P$1
  Bottom 0.152: D1.C 71.39,34.79 R16.P$1
N$10
  Top 0.152: Q1.B 62.5,36.06 62.5,32.25 65.04,29.71 R16.P$2
NMI_DIVMMC  (via drill 0.35)
  Top 0.152: v90.44,63.5 92.81,63.5 95.22,61.09 95.22,40 93.73,38.51 92.98,38.51 66.89,38.51 v66.5,38.9 | v61.8,38.9 v59.26,38.9 | v39.64,36.06 40.96,36.06 41.14,36.24 51.25,36.24 v52.34,37.33
  Bottom 0.152: JP2.6 33.15,66.43 34.14,65.44 34.14,40.57 DRIVE.1 38.65,36.06 v39.64,36.06 | JP5.10 90.44,66.3 v90.44,63.5 | v66.5,38.9 v61.8,38.9 | v52.34,37.33 53.79,37.33 54.63,36.49 58.65,36.49 59.26,37.1 v59.26,38.9
NMI_MULTIFACE  (via drill 0.35)
  Top 0.152: NMI.1 28.54,39.59 29.71,40.76 47.18,40.76 47.56,41.14 53.61,41.14 54.88,39.87 v54.88,37.1 | v58.4,37.1 v61.23,37.1 | v63.77,37.1 64.73,37.9 94.38,37.9 94.41,37.94 94.47,37.95 94.59,38.11 95.83,39.35 95.83,61.35 95.62,61.56 92.81,64.36 92.81,65.33 92.12,66.02 82.54,66.02 JP5.1
  Bottom 0.152: JP2.4 29.06,66.02 29.06,64.62 28.21,63.77 28.21,43.68 24.12,39.59 NMI.1 | v54.88,37.1 v58.4,37.1 | v61.23,37.1 v63.77,37.1
R0
  Bottom 0.152: R1.P$1 67.58,62.73 67.58,66.16 JP2.32
R1
  Bottom 0.152: R2.P$1 68.85,58.92 68.85,61.03 67.28,62.6 67.28,63.92 JP2.31
R2
  Bottom 0.152: R3.P$1 67.58,57.65 67.58,58.92 62.08,64.42 62.08,65.44 61.09,66.43 JP2.28
RAM_CE  (via drill 0.35)
  Top 0.152: IC1.8 v44.14,10.9 | JP3.3 37.14,10.7 38.37,11.93 41.97,11.93 v42.6,11.3
  Bottom 0.152: v42.6,11.3 43.74,11.3 v44.14,10.9
RAM_OE  (via drill 0.35)
  Top 0.152: IC1.37 44.14,19.05 45.69,17.5 49.8,17.5 61.58,17.5 68.85,10.23 v68.85,8.61
  Bottom 0.152: v68.85,8.61 68.85,6.26 67.72,5.13 67.72,3.73 JP1.10
RAM_WE
  Top 0.152: IC1.15 50.04,9.86 50.04,10.29 50.64,10.89 55.67,10.89 57.42,9.15 57.42,4.45 58.14,3.73 59.27,3.73 60.82,2.18 JP1.14
SD_CS  (via drill 0.35)
  Top 0.152: JP2.9 39.37,65.03 40.36,66.02 51.34,66.02 52.48,64.88 52.48,64.62 53.06,64.04 54.84,64.04 v56.15,62.73 | v56.15,57.65 58.29,59.79 58.29,60.55 60.47,62.73 v76.47,62.73
  Bottom 0.152: v56.15,62.73 v56.15,57.65 | v76.47,62.73 81.31,67.57 JP5.2
SD_CS2  (via drill 0.35)
  Top 0.152: v58.1,62.73 57.01,62.73 56.4,62.12 55.9,62.12 55.52,62.5 v42.18,62.5 | v77,61.7 60.2,61.7 58.9,60.4 v58.9,60.3 | v82.82,62.73 86.87,62.73 JP5.7
  Bottom 0.152: JP2.8 37.1,66.16 37.1,64 38.6,62.5 v42.18,62.5 | v58.1,62.73 58.9,61.93 v58.9,60.3 | v77,61.7 81.79,61.7 v82.82,62.73
SD_MISO  (via drill 0.35)
  Top 0.152: JP2.10 39.37,67.57 40.36,68.56 53.88,68.56 55.02,67.42 55.02,67.16 55.6,66.58 57.38,66.58 57.42,66.54 v62.5,66.54 | v65.04,66.54 v75.2,66.54
  Bottom 0.152: v62.5,66.54 v65.04,66.54 | v75.2,66.54 75.24,66.58 79.16,66.58 81.14,68.56 88.18,68.56 JP5.8
SD_MOSI  (via drill 0.35)
  Top 0.152: v81.8,61 81.55,61.25 81.55,62.73 83.85,65.03 JP5.3 | v56.8,56.38 v76.47,56.38
  Bottom 0.152: JP2.23 56.8,64.24 v56.8,56.38 | v76.47,56.38 79.01,56.38 81.8,59.17 v81.8,61
SD_SCK  (via drill 0.35)
  Top 0.152: JP3.1 28.98,9.39 v21.86,9.39 | v43.45,30.98 52.34,30.98 56.15,34.79 v56.15,42.41
  Bottom 0.152: v21.86,9.39 21.86,15.74 37.1,30.98 v43.45,30.98 | v56.15,42.41 58.69,42.41 61.23,44.95 65.04,44.95 v66.31,43.68 68.95,41.04 68.95,39.39 71.01,37.33 80.28,37.33 82.82,39.87 82.82,61.46 85.36,64 85.36,66.54 86.39,67.57 JP5.6
VGA_BLUE
  Top 0.152: R9.P$2 R8.P$2 R7.P$2 79.01,46.22 85.36,46.22 85.72,46.22 85.74,46.22 J1.3
VGA_GREEN
  Top 0.152: R5.P$2 82.82,50.03 83.82,49.03 J1.2 | R5.P$2 R4.P$2 | R5.P$2 R6.P$2
VGA_RED
  Top 0.152: R1.P$2 R2.P$2 R3.P$2 79.01,55.11 82.8,51.32 J1.1
VS
  Top 0.152: JP2.40 76.71,67.57 77.74,66.54 77.74,64 87.59,54.15 93.11,54.15 94.25,53 94.25,47.36 J1.14

### Text on the board
Reference: 0.1uf | 10nf | 0.1uf | 10nf
tDocu: Spectrum Next / breakout board / for MiSTer v2.0 | Ear/Mic | Audio Out